# EAGLE design hhv-dcdarknet-proto (EAGLE 7.2.0)
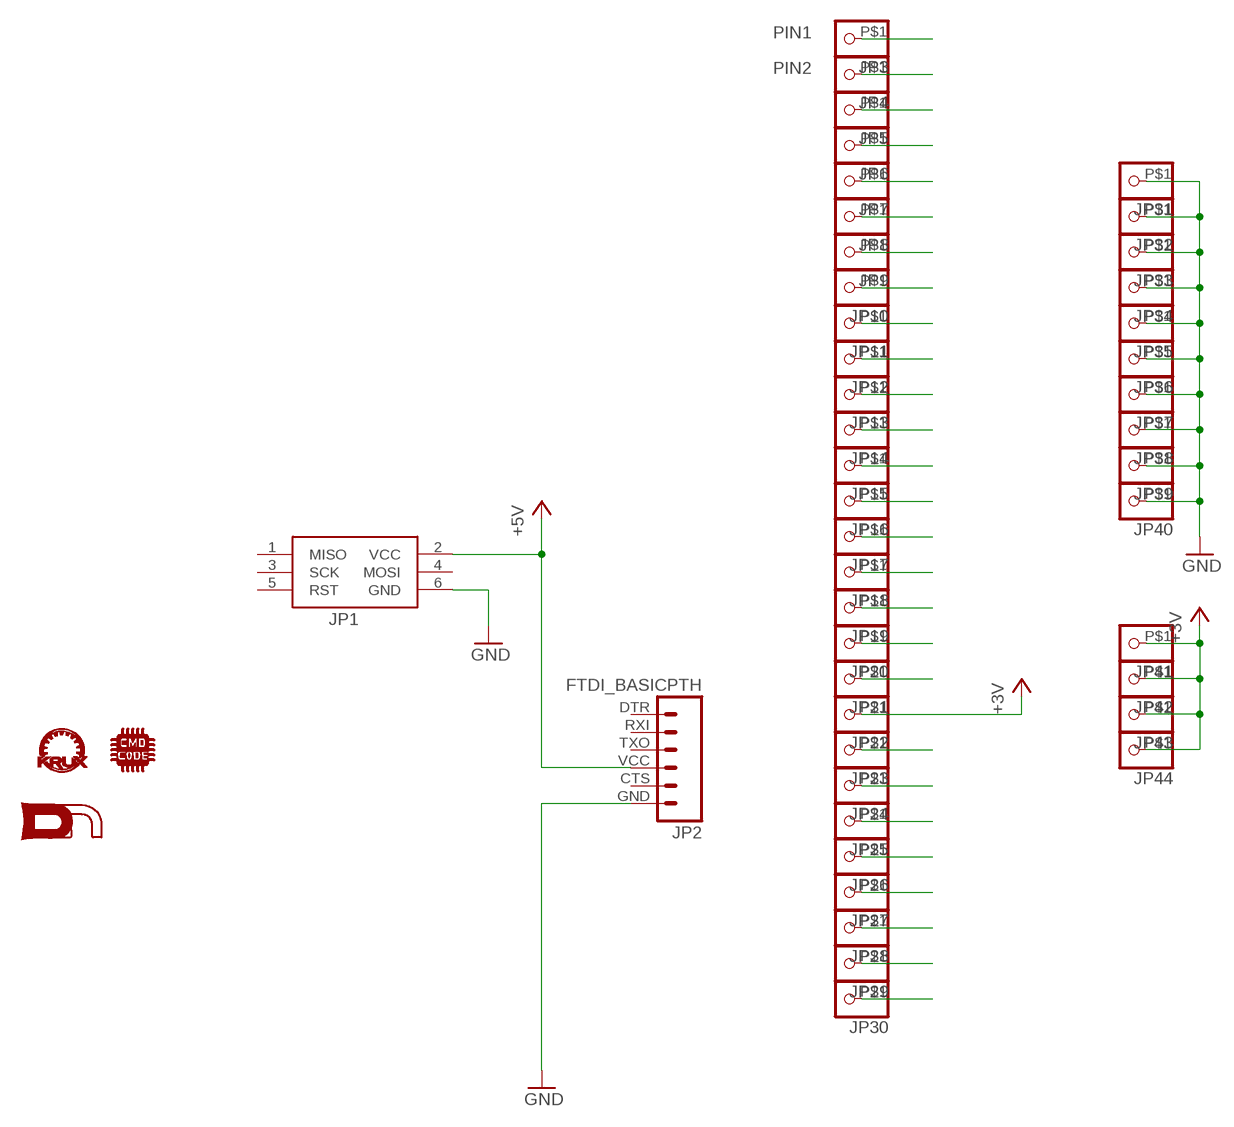
[diagram p0: schematic, sheet 1]

## Parts
JP1  JP1  AVRISP-6  [AVRISP]
JP2  FTDI_BASICPTH  [FTDI_BASIC]
JP3  PINHD-1X11X1_SQUARE  [1X1-SMALL_CUT]
JP4  PINHD-1X11X1_SQUARE  [1X1-SMALL_CUT]
JP5  PINHD-1X11X1_SQUARE  [1X1-SMALL_CUT]
JP6  PINHD-1X11X1_SQUARE  [1X1-SMALL_CUT]
JP7  PINHD-1X11X1_SQUARE  [1X1-SMALL_CUT]
JP8  PINHD-1X11X1_SQUARE  [1X1-SMALL_CUT]
JP9  PINHD-1X11X1_SQUARE  [1X1-SMALL_CUT]
JP10  PINHD-1X11X1_SQUARE  [1X1-SMALL_CUT]
JP11  PINHD-1X11X1_SQUARE  [1X1-SMALL_CUT]
JP12  PINHD-1X11X1_SQUARE  [1X1-SMALL_CUT]
JP13  PINHD-1X11X1_SQUARE  [1X1-SMALL_CUT]
JP14  PINHD-1X11X1_SQUARE  [1X1-SMALL_CUT]
JP15  PINHD-1X11X1_SQUARE  [1X1-SMALL_CUT]
JP16  PINHD-1X11X1_SQUARE  [1X1-SMALL_CUT]
JP17  PINHD-1X11X1_SQUARE  [1X1-SMALL_CUT]
JP18  PINHD-1X11X1_SQUARE  [1X1-SMALL_CUT]
JP19  PINHD-1X11X1_SQUARE  [1X1-SMALL_CUT]
JP20  PINHD-1X11X1_SQUARE  [1X1-SMALL_CUT]
JP21  PINHD-1X11X1_SQUARE  [1X1-SMALL_CUT]
JP22  PINHD-1X11X1_SQUARE  [1X1-SMALL_CUT]
JP23  PINHD-1X11X1_SQUARE  [1X1-SMALL_CUT]
JP24  PINHD-1X11X1_SQUARE  [1X1-SMALL_CUT]
JP25  PINHD-1X11X1_SQUARE  [1X1-SMALL_CUT]
JP26  PINHD-1X11X1_SQUARE  [1X1-SMALL_CUT]
JP27  PINHD-1X11X1_SQUARE  [1X1-SMALL_CUT]
JP28  PINHD-1X11X1_SQUARE  [1X1-SMALL_CUT]
JP29  PINHD-1X11X1_SQUARE  [1X1-SMALL_CUT]
JP30  PINHD-1X11X1_SQUARE  [1X1-SMALL_CUT]
JP31  PINHD-1X11X1_SQUARE  [1X1-SMALL_CUT]
JP32  PINHD-1X11X1_SQUARE  [1X1-SMALL_CUT]
JP33  PINHD-1X11X1_SQUARE  [1X1-SMALL_CUT]
JP34  PINHD-1X11X1_SQUARE  [1X1-SMALL_CUT]
JP35  PINHD-1X11X1_SQUARE  [1X1-SMALL_CUT]
JP36  PINHD-1X11X1_SQUARE  [1X1-SMALL_CUT]
JP37  PINHD-1X11X1_SQUARE  [1X1-SMALL_CUT]
JP38  PINHD-1X11X1_SQUARE  [1X1-SMALL_CUT]
JP39  PINHD-1X11X1_SQUARE  [1X1-SMALL_CUT]
JP40  PINHD-1X11X1_SQUARE  [1X1-SMALL_CUT]
JP41  PINHD-1X11X1_SQUARE  [1X1-SMALL_CUT]
JP42  PINHD-1X11X1_SQUARE  [1X1-SMALL_CUT]
JP43  PINHD-1X11X1_SQUARE  [1X1-SMALL_CUT]
JP44  PINHD-1X11X1_SQUARE  [1X1-SMALL_CUT]
U$1  KRUX_LOGO  [KRUX_LOGO]
U$2  DN_LOGO  [DN_LOGO]
U$3  CMDC0DE_LOGO  [CMDC0DE]

## Nets
+3V3: JP9.P$1 JP22.P$1 JP41.P$1 JP42.P$1 JP43.P$1 JP44.P$1 ; supply symbol labelled +3V
+5V: JP1.2(VCC) JP2.VCC
GND: JP1.6(GND) JP2.GND JP10.P$1 JP31.P$1 JP32.P$1 JP33.P$1 JP34.P$1 JP35.P$1 JP36.P$1 JP37.P$1 JP38.P$1 JP39.P$1 JP40.P$1
PIN1: JP3.P$1
PIN2: JP4.P$1
PIN3: JP5.P$1
PIN4: JP6.P$1
PIN5: JP7.P$1
PIN6: JP8.P$1
PIN9: JP11.P$1
PIN10: JP12.P$1
PIN11: JP13.P$1
PIN12: JP14.P$1
PIN13: JP15.P$1
PIN14: JP16.P$1
PIN15: JP17.P$1
PIN16: JP18.P$1
PIN17: JP19.P$1
PIN18: JP20.P$1
PIN19: JP21.P$1
PIN21: JP23.P$1
PIN22: JP24.P$1
PIN23: JP25.P$1
PIN24: JP26.P$1
PIN25: JP27.P$1
PIN26: JP28.P$1
PIN27: JP29.P$1
PIN28: JP30.P$1
Unconnected: JP1.1(MISO) JP1.3(SCK) JP1.4(MOSI) JP1.5(RST) JP2.CTS JP2.DTR JP2.RXI JP2.TXO

## Library data of the parts
JP1 = SYNShop:AVRISP: AVR ISP HEADER Standard 6 pin header for AVR programming
JP2 = SparkFun:FTDI_BASIC: FTDI Basic: 3.3V and 5V
JP3-JP44 = adafruit:PINHD-1X1: Pin header 1x1 for 0.1" spacing With round pins
U$1 = SYNShop:KRUX_LOGO
U$2 = SYNShop:DN_LOGO
U$3 = SYNShop:CMDC0DE_LOGO

## Net classes
0 default: clearance 0.205 mm

## Board
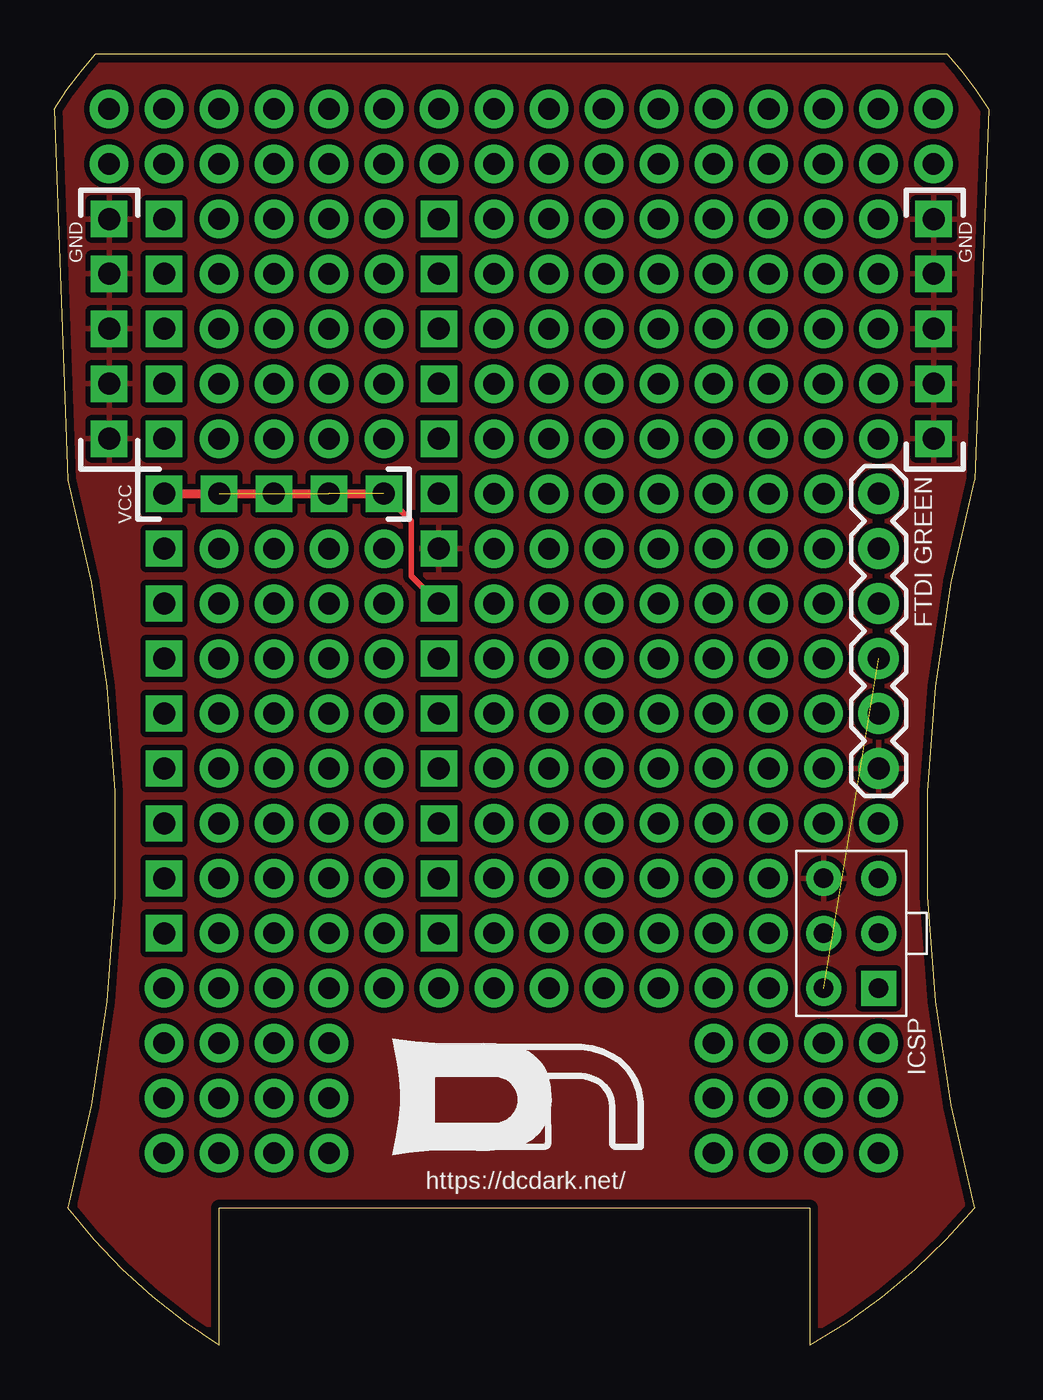
[diagram p1: board, top side]
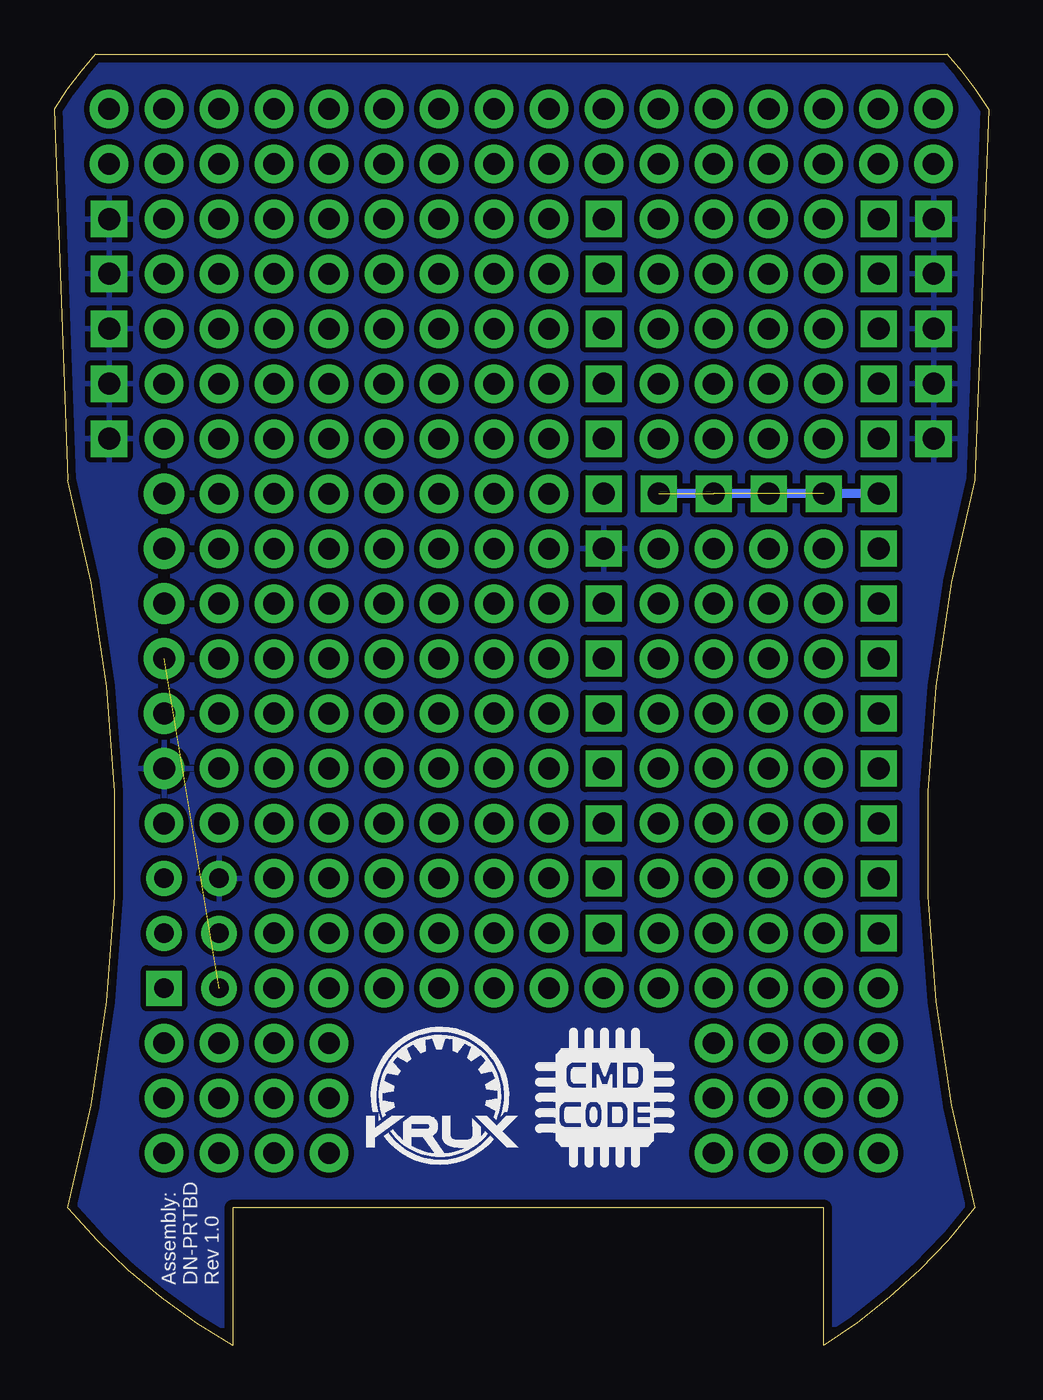
[diagram p2: board, bottom side, seen from below]

Size 43.18 x 59.69 mm. Coordinates in mm from the lower left corner, seen from the top.
Outline: 0.63,40.01 arc-30 0.63,6.35 arc20 7.62,0 7.62,6.35 34.93,6.35 34.93,0 arc20 42.54,6.35 arc-30 42.54,40.01 43.18,57.15 arc10 41.27,59.69 1.91,59.69 arc10 0,57.15 0.63,40.01
Copper layers (1*16): Top 0.0356mm / dielectric 1.5011mm / Bottom 0.0356mm
Design rules "LaenPCBOrder": minimum track width 6mil, minimum drill 13mil, track to track 6mil, track to pad 6mil, pad to pad 6mil, via to via 6mil, smd to smd 6mil, copper to edge 15mil, drill to drill 6mil, minimum pad ring 7mil, minimum via ring 7mil, stop-mask expansion 4mil, vias tented up to drill 0mil, thermal gap 10mil

### Footprints (pad centres in the part's own frame; a part is rotated, then mirrored left to right if it is on the bottom)
AVRISP = drill 0.9 pad 1.626 square: 1 -1.27,2.54 | drill 0.9 pad 1.626: 2 1.27,2.54; 3 -1.27,0; 4 1.27,0; 5 -1.27,-2.54; 6 1.27,-2.54
FTDI_BASIC = drill 1.016 pad 1.88: CTS 10.16,0; DTR 0,0; GND 12.7,0; RXI 2.54,0; TXO 5.08,0; VCC 7.62,0
1X1-SMALL_CUT = drill 1.016 pad 1.676 square: P$1 0,0

### Placement (x,y rotation side)
JP1  36.83,19.05 180 top
JP2  38.1,39.37 270 top
JP3  17.78,19.05 0 top
JP4  17.78,21.59 0 top
JP5  17.78,24.13 0 top
JP6  17.78,26.67 0 top
JP7  17.78,29.21 0 top
JP8  17.78,31.75 0 top
JP9  17.78,34.29 0 top
JP10  17.78,36.83 0 top
JP11  17.78,39.37 0 top
JP12  17.78,41.91 0 top
JP13  17.78,44.45 0 top
JP14  17.78,46.99 0 top
JP15  17.78,49.53 0 top
JP16  17.78,52.07 0 top
JP17  5.08,52.07 0 top
JP18  5.08,49.53 0 top
JP19  5.08,46.99 0 top
JP20  5.08,44.45 0 top
JP21  5.08,41.91 0 top
JP22  5.08,39.37 0 top
JP23  5.08,36.83 0 top
JP24  5.08,34.29 0 top
JP25  5.08,31.75 0 top
JP26  5.08,29.21 0 top
JP27  5.08,26.67 0 top
JP28  5.08,24.13 0 top
JP29  5.08,21.59 0 top
JP30  5.08,19.05 0 top
JP31  2.54,52.07 0 top
JP32  2.54,49.53 0 top
JP33  2.54,46.99 0 top
JP34  2.54,44.45 180 top
JP35  2.54,41.91 0 top
JP36  40.64,52.07 0 top
JP37  40.64,49.53 0 top
JP38  40.64,46.99 0 top
JP39  40.64,44.45 0 top
JP40  40.64,41.91 0 top
JP41  7.62,39.37 0 top
JP42  10.16,39.37 0 top
JP43  12.7,39.37 0 top
JP44  15.24,39.37 0 top
U$1  25.38,11.6 0 bottom
U$2  15.24,8.89 0 top
U$3  17.74,11.46 0 bottom

### Tracks (layer width: path | path; a pad name or v marks a point on that pad's centre or on a via)
+3V3  (3 unrouted)
  Top 0.254: JP9.P$1 16.51,35.56 16.51,38.1 JP44.P$1
  Top 0.406: JP22.P$1 JP44.P$1
  Bottom 0.406: JP22.P$1 JP44.P$1
+5V  (1 unrouted)
GND
  pour Top (isolate 0.254): 2.22,59.37 0,57.15 0.63,40.01 1.27,38.1 2.54,30.48 2.86,20.64 2.22,13.34 0.63,6.35 2.54,4.13 4.76,1.91 7.62,0 7.62,6.35 34.93,6.35 34.93,0 36.83,1.27 39.37,3.49 42.23,6.35 41.27,11.11 40.64,16.19 40.32,24.77 40.96,32.7 42.54,40.01 43.18,56.83 40.96,59.69
  pour Bottom (isolate 0.254): 2.22,59.37 0,57.15 0.63,40.01 1.27,38.1 2.54,30.48 2.86,20.64 2.22,13.34 0.63,6.35 2.54,4.13 4.76,1.91 7.62,0 7.62,6.35 34.93,6.35 34.93,0 36.83,1.27 39.37,3.49 42.23,6.35 41.27,11.11 40.64,16.19 40.32,24.77 40.96,32.7 42.54,40.01 43.18,56.83 40.96,59.69
N$1  (via drill 1 pad 1.78)
  other vias: 7.62,52.07
N$2  (via drill 1 pad 1.78)
  other vias: 7.62,49.53
N$3  (via drill 1 pad 1.78)
  other vias: 7.62,46.99
N$4  (via drill 1 pad 1.78)
  other vias: 7.62,44.45
N$5  (via drill 1 pad 1.78)
  other vias: 7.62,41.91
N$6  (via drill 1 pad 1.78)
  other vias: 5.08,16.51
N$8  (via drill 1 pad 1.78)
  other vias: 7.62,36.83
N$9  (via drill 1 pad 1.78)
  other vias: 7.62,16.51
N$10  (via drill 1 pad 1.78)
  other vias: 10.16,16.51
N$11  (via drill 1 pad 1.78)
  other vias: 7.62,34.29
N$12  (via drill 1 pad 1.78)
  other vias: 7.62,31.75
N$13  (via drill 1 pad 1.78)
  other vias: 7.62,29.21
N$14  (via drill 1 pad 1.78)
  other vias: 7.62,26.67
N$15  (via drill 1 pad 1.78)
  other vias: 7.62,24.13
N$16  (via drill 1 pad 1.78)
  other vias: 12.7,16.51
N$17  (via drill 1 pad 1.78)
  other vias: 7.62,21.59
N$18  (via drill 1 pad 1.78)
  other vias: 7.62,19.05
N$19  (via drill 1 pad 1.78)
  other vias: 10.16,19.05
N$20  (via drill 1 pad 1.78)
  other vias: 10.16,21.59
N$21  (via drill 1 pad 1.78)
  other vias: 10.16,24.13
N$22  (via drill 1 pad 1.78)
  other vias: 10.16,26.67
N$23  (via drill 1 pad 1.78)
  other vias: 10.16,29.21
N$24  (via drill 1 pad 1.78)
  other vias: 15.24,16.51
N$25  (via drill 1 pad 1.78)
  other vias: 10.16,31.75
N$26  (via drill 1 pad 1.78)
  other vias: 10.16,34.29
N$27  (via drill 1 pad 1.78)
  other vias: 10.16,36.83
N$29  (via drill 1 pad 1.78)
  other vias: 10.16,41.91
N$30  (via drill 1 pad 1.78)
  other vias: 10.16,44.45
N$31  (via drill 1 pad 1.78)
  other vias: 10.16,46.99
N$32  (via drill 1 pad 1.78)
  other vias: 10.16,49.53
N$33  (via drill 1 pad 1.78)
  other vias: 10.16,52.07
N$34  (via drill 1 pad 1.78)
  other vias: 12.7,52.07
N$35  (via drill 1 pad 1.78)
  other vias: 15.24,52.07
N$36  (via drill 1 pad 1.78)
  other vias: 15.24,49.53
N$37  (via drill 1 pad 1.78)
  other vias: 12.7,49.53
N$38  (via drill 1 pad 1.78)
  other vias: 12.7,46.99
N$39  (via drill 1 pad 1.78)
  other vias: 15.24,46.99
N$40  (via drill 1 pad 1.78)
  other vias: 15.24,44.45
N$41  (via drill 1 pad 1.78)
  other vias: 12.7,44.45
N$42  (via drill 1 pad 1.78)
  other vias: 12.7,41.91
N$43  (via drill 1 pad 1.78)
  other vias: 15.24,41.91
N$46  (via drill 1 pad 1.78)
  other vias: 12.7,36.83
N$47  (via drill 1 pad 1.78)
  other vias: 15.24,36.83
N$48  (via drill 1 pad 1.78)
  other vias: 15.24,34.29
N$49  (via drill 1 pad 1.78)
  other vias: 12.7,34.29
N$50  (via drill 1 pad 1.78)
  other vias: 12.7,31.75
N$51  (via drill 1 pad 1.78)
  other vias: 15.24,31.75
N$52  (via drill 1 pad 1.78)
  other vias: 15.24,29.21
N$53  (via drill 1 pad 1.78)
  other vias: 12.7,29.21
N$54  (via drill 1 pad 1.78)
  other vias: 12.7,26.67
N$55  (via drill 1 pad 1.78)
  other vias: 15.24,26.67
N$56  (via drill 1 pad 1.78)
  other vias: 15.24,24.13
N$57  (via drill 1 pad 1.78)
  other vias: 12.7,24.13
N$58  (via drill 1 pad 1.78)
  other vias: 12.7,21.59
N$59  (via drill 1 pad 1.78)
  other vias: 15.24,21.59
N$60  (via drill 1 pad 1.78)
  other vias: 15.24,19.05
N$61  (via drill 1 pad 1.78)
  other vias: 12.7,19.05
N$62  (via drill 1 pad 1.78)
  other vias: 20.32,19.05
N$63  (via drill 1 pad 1.78)
  other vias: 22.86,19.05
N$64  (via drill 1 pad 1.78)
  other vias: 25.4,19.05
N$65  (via drill 1 pad 1.78)
  other vias: 27.94,19.05
N$66  (via drill 1 pad 1.78)
  other vias: 30.48,19.05
N$67  (via drill 1 pad 1.78)
  other vias: 33.02,19.05
N$68  (via drill 1 pad 1.78)
  other vias: 33.02,21.59
N$69  (via drill 1 pad 1.78)
  other vias: 30.48,21.59
N$70  (via drill 1 pad 1.78)
  other vias: 27.94,21.59
N$71  (via drill 1 pad 1.78)
  other vias: 25.4,21.59
N$72  (via drill 1 pad 1.78)
  other vias: 22.86,21.59
N$73  (via drill 1 pad 1.78)
  other vias: 20.32,21.59
N$74  (via drill 1 pad 1.78)
  other vias: 20.32,24.13
N$75  (via drill 1 pad 1.78)
  other vias: 22.86,24.13
N$76  (via drill 1 pad 1.78)
  other vias: 25.4,24.13
N$77  (via drill 1 pad 1.78)
  other vias: 27.94,24.13
N$78  (via drill 1 pad 1.78)
  other vias: 30.48,24.13
N$79  (via drill 1 pad 1.78)
  other vias: 33.02,24.13
N$80  (via drill 1 pad 1.78)
  other vias: 35.56,24.13
N$81  (via drill 1 pad 1.78)
  other vias: 38.1,24.13
N$82  (via drill 1 pad 1.78)
  other vias: 35.56,26.67
N$83  (via drill 1 pad 1.78)
  other vias: 33.02,26.67
N$84  (via drill 1 pad 1.78)
  other vias: 30.48,26.67
N$85  (via drill 1 pad 1.78)
  other vias: 27.94,26.67
N$86  (via drill 1 pad 1.78)
  other vias: 25.4,26.67
N$87  (via drill 1 pad 1.78)
  other vias: 22.86,26.67
N$88  (via drill 1 pad 1.78)
  other vias: 20.32,26.67
N$89  (via drill 1 pad 1.78)
  other vias: 20.32,29.21
N$90  (via drill 1 pad 1.78)
  other vias: 22.86,29.21
N$91  (via drill 1 pad 1.78)
  other vias: 25.4,29.21
N$92  (via drill 1 pad 1.78)
  other vias: 27.94,29.21
N$93  (via drill 1 pad 1.78)
  other vias: 30.48,29.21
N$94  (via drill 1 pad 1.78)
  other vias: 33.02,29.21
N$95  (via drill 1 pad 1.78)
  other vias: 35.56,29.21
N$96  (via drill 1 pad 1.78)
  other vias: 35.56,31.75
N$97  (via drill 1 pad 1.78)
  other vias: 33.02,31.75
N$98  (via drill 1 pad 1.78)
  other vias: 30.48,31.75
N$99  (via drill 1 pad 1.78)
  other vias: 27.94,31.75
N$100  (via drill 1 pad 1.78)
  other vias: 25.4,31.75
N$101  (via drill 1 pad 1.78)
  other vias: 22.86,31.75
N$102  (via drill 1 pad 1.78)
  other vias: 20.32,31.75
N$103  (via drill 1 pad 1.78)
  other vias: 20.32,34.29
N$104  (via drill 1 pad 1.78)
  other vias: 22.86,34.29
N$105  (via drill 1 pad 1.78)
  other vias: 25.4,34.29
N$106  (via drill 1 pad 1.78)
  other vias: 27.94,34.29
N$107  (via drill 1 pad 1.78)
  other vias: 30.48,34.29
N$108  (via drill 1 pad 1.78)
  other vias: 33.02,34.29
N$109  (via drill 1 pad 1.78)
  other vias: 35.56,34.29
N$110  (via drill 1 pad 1.78)
  other vias: 35.56,36.83
N$111  (via drill 1 pad 1.78)
  other vias: 33.02,36.83
N$112  (via drill 1 pad 1.78)
  other vias: 30.48,36.83
N$113  (via drill 1 pad 1.78)
  other vias: 27.94,36.83
N$114  (via drill 1 pad 1.78)
  other vias: 25.4,36.83
N$115  (via drill 1 pad 1.78)
  other vias: 22.86,36.83
N$116  (via drill 1 pad 1.78)
  other vias: 20.32,36.83
N$117  (via drill 1 pad 1.78)
  other vias: 20.32,39.37
N$118  (via drill 1 pad 1.78)
  other vias: 22.86,39.37
N$119  (via drill 1 pad 1.78)
  other vias: 25.4,39.37
N$120  (via drill 1 pad 1.78)
  other vias: 27.94,39.37
N$121  (via drill 1 pad 1.78)
  other vias: 30.48,39.37
N$122  (via drill 1 pad 1.78)
  other vias: 33.02,39.37
N$123  (via drill 1 pad 1.78)
  other vias: 35.56,39.37
N$124  (via drill 1 pad 1.78)
  other vias: 20.32,41.91
N$125  (via drill 1 pad 1.78)
  other vias: 22.86,41.91
N$126  (via drill 1 pad 1.78)
  other vias: 25.4,41.91
N$127  (via drill 1 pad 1.78)
  other vias: 27.94,41.91
N$128  (via drill 1 pad 1.78)
  other vias: 30.48,41.91
N$129  (via drill 1 pad 1.78)
  other vias: 33.02,41.91
N$130  (via drill 1 pad 1.78)
  other vias: 35.56,41.91
N$131  (via drill 1 pad 1.78)
  other vias: 38.1,41.91
N$132  (via drill 1 pad 1.78)
  other vias: 38.1,44.45
N$133  (via drill 1 pad 1.78)
  other vias: 38.1,46.99
N$134  (via drill 1 pad 1.78)
  other vias: 38.1,49.53
N$135  (via drill 1 pad 1.78)
  other vias: 38.1,52.07
N$136  (via drill 1 pad 1.78)
  other vias: 35.56,44.45
N$137  (via drill 1 pad 1.78)
  other vias: 35.56,46.99
N$138  (via drill 1 pad 1.78)
  other vias: 35.56,49.53
N$139  (via drill 1 pad 1.78)
  other vias: 35.56,52.07
N$140  (via drill 1 pad 1.78)
  other vias: 33.02,44.45
N$141  (via drill 1 pad 1.78)
  other vias: 33.02,46.99
N$142  (via drill 1 pad 1.78)
  other vias: 33.02,49.53
N$143  (via drill 1 pad 1.78)
  other vias: 33.02,52.07
N$144  (via drill 1 pad 1.78)
  other vias: 30.48,44.45
N$145  (via drill 1 pad 1.78)
  other vias: 30.48,46.99
N$146  (via drill 1 pad 1.78)
  other vias: 30.48,49.53
N$147  (via drill 1 pad 1.78)
  other vias: 30.48,52.07
N$148  (via drill 1 pad 1.78)
  other vias: 27.94,44.45
N$149  (via drill 1 pad 1.78)
  other vias: 27.94,46.99
N$150  (via drill 1 pad 1.78)
  other vias: 27.94,49.53
N$151  (via drill 1 pad 1.78)
  other vias: 27.94,52.07
N$152  (via drill 1 pad 1.78)
  other vias: 25.4,44.45
N$153  (via drill 1 pad 1.78)
  other vias: 25.4,46.99
N$154  (via drill 1 pad 1.78)
  other vias: 25.4,49.53
N$155  (via drill 1 pad 1.78)
  other vias: 25.4,52.07
N$156  (via drill 1 pad 1.78)
  other vias: 22.86,44.45
N$157  (via drill 1 pad 1.78)
  other vias: 22.86,46.99
N$158  (via drill 1 pad 1.78)
  other vias: 22.86,49.53
N$159  (via drill 1 pad 1.78)
  other vias: 22.86,52.07
N$160  (via drill 1 pad 1.78)
  other vias: 20.32,44.45
N$161  (via drill 1 pad 1.78)
  other vias: 20.32,46.99
N$162  (via drill 1 pad 1.78)
  other vias: 20.32,49.53
N$163  (via drill 1 pad 1.78)
  other vias: 20.32,52.07
N$174  (via drill 1 pad 1.78)
  other vias: 2.54,54.61
N$175  (via drill 1 pad 1.78)
  other vias: 5.08,54.61
N$176  (via drill 1 pad 1.78)
  other vias: 7.62,54.61
N$177  (via drill 1 pad 1.78)
  other vias: 10.16,54.61
N$178  (via drill 1 pad 1.78)
  other vias: 12.7,54.61
N$179  (via drill 1 pad 1.78)
  other vias: 15.24,54.61
N$180  (via drill 1 pad 1.78)
  other vias: 17.78,54.61
N$181  (via drill 1 pad 1.78)
  other vias: 20.32,54.61
N$182  (via drill 1 pad 1.78)
  other vias: 22.86,54.61
N$183  (via drill 1 pad 1.78)
  other vias: 25.4,54.61
N$184  (via drill 1 pad 1.78)
  other vias: 27.94,54.61
N$185  (via drill 1 pad 1.78)
  other vias: 30.48,54.61
N$186  (via drill 1 pad 1.78)
  other vias: 33.02,54.61
N$187  (via drill 1 pad 1.78)
  other vias: 35.56,54.61
N$188  (via drill 1 pad 1.78)
  other vias: 38.1,54.61
N$189  (via drill 1 pad 1.78)
  other vias: 40.64,54.61
N$190  (via drill 1 pad 1.78)
  other vias: 40.64,57.15
N$191  (via drill 1 pad 1.78)
  other vias: 38.1,57.15
N$192  (via drill 1 pad 1.78)
  other vias: 35.56,57.15
N$193  (via drill 1 pad 1.78)
  other vias: 33.02,57.15
N$194  (via drill 1 pad 1.78)
  other vias: 30.48,57.15
N$195  (via drill 1 pad 1.78)
  other vias: 27.94,57.15
N$196  (via drill 1 pad 1.78)
  other vias: 25.4,57.15
N$197  (via drill 1 pad 1.78)
  other vias: 22.86,57.15
N$198  (via drill 1 pad 1.78)
  other vias: 20.32,57.15
N$199  (via drill 1 pad 1.78)
  other vias: 17.78,57.15
N$200  (via drill 1 pad 1.78)
  other vias: 15.24,57.15
N$201  (via drill 1 pad 1.78)
  other vias: 12.7,57.15
N$202  (via drill 1 pad 1.78)
  other vias: 10.16,57.15
N$203  (via drill 1 pad 1.78)
  other vias: 7.62,57.15
N$204  (via drill 1 pad 1.78)
  other vias: 5.08,57.15
N$205  (via drill 1 pad 1.78)
  other vias: 2.54,57.15
N$206  (via drill 1 pad 1.78)
  other vias: 17.78,16.51
N$207  (via drill 1 pad 1.78)
  other vias: 20.32,16.51
N$208  (via drill 1 pad 1.78)
  other vias: 22.86,16.51
N$209  (via drill 1 pad 1.78)
  other vias: 25.4,16.51
N$210  (via drill 1 pad 1.78)
  other vias: 27.94,16.51
N$211  (via drill 1 pad 1.78)
  other vias: 30.48,16.51
N$212  (via drill 1 pad 1.78)
  other vias: 33.02,16.51
N$213  (via drill 1 pad 1.78)
  other vias: 38.1,13.97
N$214  (via drill 1 pad 1.78)
  other vias: 35.56,13.97
N$215  (via drill 1 pad 1.78)
  other vias: 33.02,13.97
N$216  (via drill 1 pad 1.78)
  other vias: 30.48,13.97
N$223  (via drill 1 pad 1.78)
  other vias: 12.7,13.97
N$224  (via drill 1 pad 1.78)
  other vias: 10.16,13.97
N$225  (via drill 1 pad 1.78)
  other vias: 7.62,13.97
N$226  (via drill 1 pad 1.78)
  other vias: 5.08,13.97
N$227  (via drill 1 pad 1.78)
  other vias: 5.08,11.43
N$228  (via drill 1 pad 1.78)
  other vias: 7.62,11.43
N$229  (via drill 1 pad 1.78)
  other vias: 10.16,11.43
N$230  (via drill 1 pad 1.78)
  other vias: 12.7,11.43
N$237  (via drill 1 pad 1.78)
  other vias: 30.48,11.43
N$238  (via drill 1 pad 1.78)
  other vias: 33.02,11.43
N$239  (via drill 1 pad 1.78)
  other vias: 35.56,11.43
N$240  (via drill 1 pad 1.78)
  other vias: 38.1,11.43
N$241  (via drill 1 pad 1.78)
  other vias: 38.1,8.89
N$242  (via drill 1 pad 1.78)
  other vias: 35.56,8.89
N$243  (via drill 1 pad 1.78)
  other vias: 33.02,8.89
N$244  (via drill 1 pad 1.78)
  other vias: 30.48,8.89
N$251  (via drill 1 pad 1.78)
  other vias: 12.7,8.89
N$252  (via drill 1 pad 1.78)
  other vias: 10.16,8.89
N$253  (via drill 1 pad 1.78)
  other vias: 7.62,8.89
N$254  (via drill 1 pad 1.78)
  other vias: 5.08,8.89

### Text on the board
_tsilk: GND | GND | VCC | FTDI GREEN | ICSP | https://dcdark.net/
_bsilk: Assembly: / DN-PRTBD / Rev 1.0